# EAGLE schematic Serial Board (EAGLE 6.4)
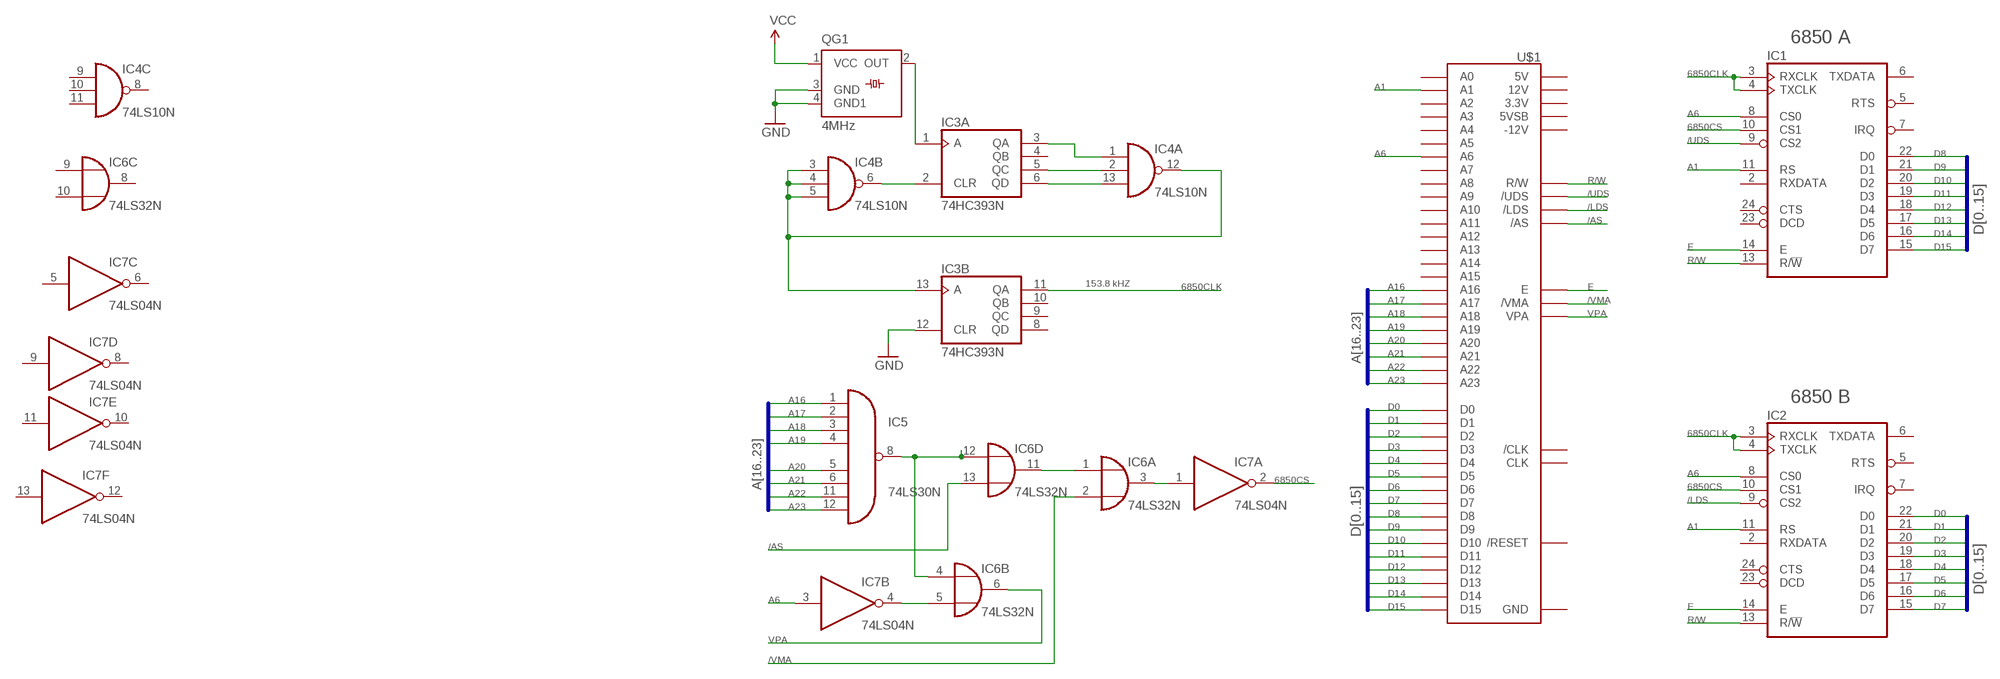
[diagram p0: schematic, sheet 1]

## Parts
IC1  6850  [DIL24]
IC2  6850  [DIL24]
IC3  74HC393N  [DIL14]
IC4  74LS10N  [DIL14]
IC5  74LS30N  [DIL14]
IC6  74LS32N  [DIL14]
IC7  74LS04N  [DIL14]
QG1  4MHz  TC49C  [TC49]
U$1  BLANKBOARD  [BLANKBOARD]

## Nets
6850CLK: IC1.3(RXCLK) IC1.4(TXCLK) IC2.3(RXCLK) IC2.4(TXCLK) IC3.11(B:QA)
6850CS: IC1.10(CS1) IC2.10(CS1) IC7.2(A:O)
/AS: IC6.13(D:I1) U$1./AS
/LDS: IC2.9(CS2) U$1./LDS
/UDS: IC1.9(CS2) U$1./UDS
/VMA: IC6.2(A:I1) U$1./VMA
A1: IC1.11(RS) IC2.11(RS) U$1.A1
A6: IC1.8(CS0) IC2.8(CS0) IC7.3(B:I) U$1.A6
A16: IC5.1(I0) U$1.A16
A17: IC5.2(I1) U$1.A17
A18: IC5.3(I2) U$1.A18
A19: IC5.4(I3) U$1.A19
A20: IC5.5(I4) U$1.A20
A21: IC5.6(I5) U$1.A21
A22: IC5.11(I6) U$1.A22
A23: IC5.12(I7) U$1.A23
D0: IC2.22(D0) U$1.D0
D1: IC2.21(D1) U$1.D1
D2: IC2.20(D2) U$1.D2
D3: IC2.19(D3) U$1.D3
D4: IC2.18(D4) U$1.D4
D5: IC2.17(D5) U$1.D5
D6: IC2.16(D6) U$1.D6
D7: IC2.15(D7) U$1.D7
D8: IC1.22(D0) U$1.D8
D9: IC1.21(D1) U$1.D9
D10: IC1.20(D2) U$1.D10
D11: IC1.19(D3) U$1.D11
D12: IC1.18(D4) U$1.D12
D13: IC1.17(D5) U$1.D13
D14: IC1.16(D6) U$1.D14
D15: IC1.15(D7) U$1.D15
E: IC1.14(E) IC2.14(E) U$1.E
GND: IC3.12(B:CLR) QG1.3(GND) QG1.4(GND1)
N$4: IC3.5(A:QC) IC4.2(A:I1)
N$5: IC3.6(A:QD) IC4.13(A:I2)
N$6: IC3.3(A:QA) IC4.1(A:I0)
N$7: IC3.2(A:CLR) IC4.6(B:O)
N$8: IC3.13(B:A) IC4.3(B:I0) IC4.4(B:I1) IC4.5(B:I2) IC4.12(A:O)
N$9: IC5.8(O) IC6.4(B:I0) IC6.12(D:I0)
N$10: IC3.1(A:A) QG1.2(OUT)
N$11: IC6.5(B:I1) IC7.4(B:O)
N$12: IC6.3(A:O) IC7.1(A:I)
N$13: IC6.1(A:I0) IC6.11(D:O)
R/W: IC1.13(R/!W) IC2.13(R/!W) U$1.R/W
VCC: QG1.1(VCC)
VPA: IC6.6(B:O) U$1.VPA
Unconnected: IC1.2(RXDATA) IC1.5(RTS) IC1.6(TXDATA) IC1.7(IRQ) IC1.23(DCD) IC1.24(CTS) IC2.2(RXDATA) IC2.5(RTS) IC2.6(TXDATA) IC2.7(IRQ) IC2.23(DCD) IC2.24(CTS) IC3.4(A:QB) IC3.8(B:QD) IC3.9(B:QC) IC3.10(B:QB) IC4.8(C:O) IC4.9(C:I0) IC4.10(C:I1) IC4.11(C:I2) IC6.8(C:O) IC6.9(C:I0) IC6.10(C:I1) IC7.5(C:I) IC7.6(C:O) IC7.8(D:O) IC7.9(D:I) IC7.10(E:O) IC7.11(E:I) IC7.12(F:O) IC7.13(F:I) U$1.3V3(3.3V) U$1.5V U$1.5VSB U$1.12V U$1.-12V U$1./CLK U$1./RESET U$1.A0 U$1.A2 U$1.A3 U$1.A4 U$1.A5 U$1.A7 U$1.A8 U$1.A9 U$1.A10 U$1.A11 U$1.A12 U$1.A13 U$1.A14 U$1.A15 U$1.CLK U$1.GND

## Buses
D[0..15]
A[16..23]

## Notes on the sheet
- 6850 A
- 153.8 kHZ
- 6850 B

## Power pins joined to a net without a drawn wire
GND: IC3.7(P:GND) IC4.7(P:GND) IC5.7(GND) IC6.7(P:GND) IC7.7(P:GND)
VCC: IC1.12(VCC) IC2.12(VCC) IC3.14(P:VCC) IC4.14(P:VCC) IC5.14(VCC) IC6.14(P:VCC) IC7.14(P:VCC)
VSS: IC1.1(VSS) IC2.1(VSS)

## Library data of the parts
IC1 IC2 = micro-motorola:6850: MICROCONTROLLER/MEMORY DEVICE; MF: NTE ELECTRONICS; MPN: NTE6850; OC_FARNELL: 4899775; OC_NEWARK: 31C2457
IC3 = 74xx-eu:74*393: Dual 4-bit decade and binary COUNTER
IC4 = 74xx-eu:74*10: Triple 3-input NAND gate
IC5 = 74xx-eu:74*30: 8-input NAND gate
IC6 = 74xx-eu:74*32: Quad 2-input OR gate
IC7 = 74xx-eu:74*04: Hex INVERTER
QG1 = crystal:TC49: Temperature Compensated Xtal Oscillator HCMOS, Clipped Sine Wave or Sine Wave Compatible Source: www.pletronics.com .. tc4.pdf; OC_FARNELL: unknown; OC_NEWARK: unknown
U$1 = Benchoff:BLANKBOARD